# EAGLE schematic DistributedVisionSchematicPagePRAC (EAGLE 9.6.2)

## Sheet 1 of 4: Page 1
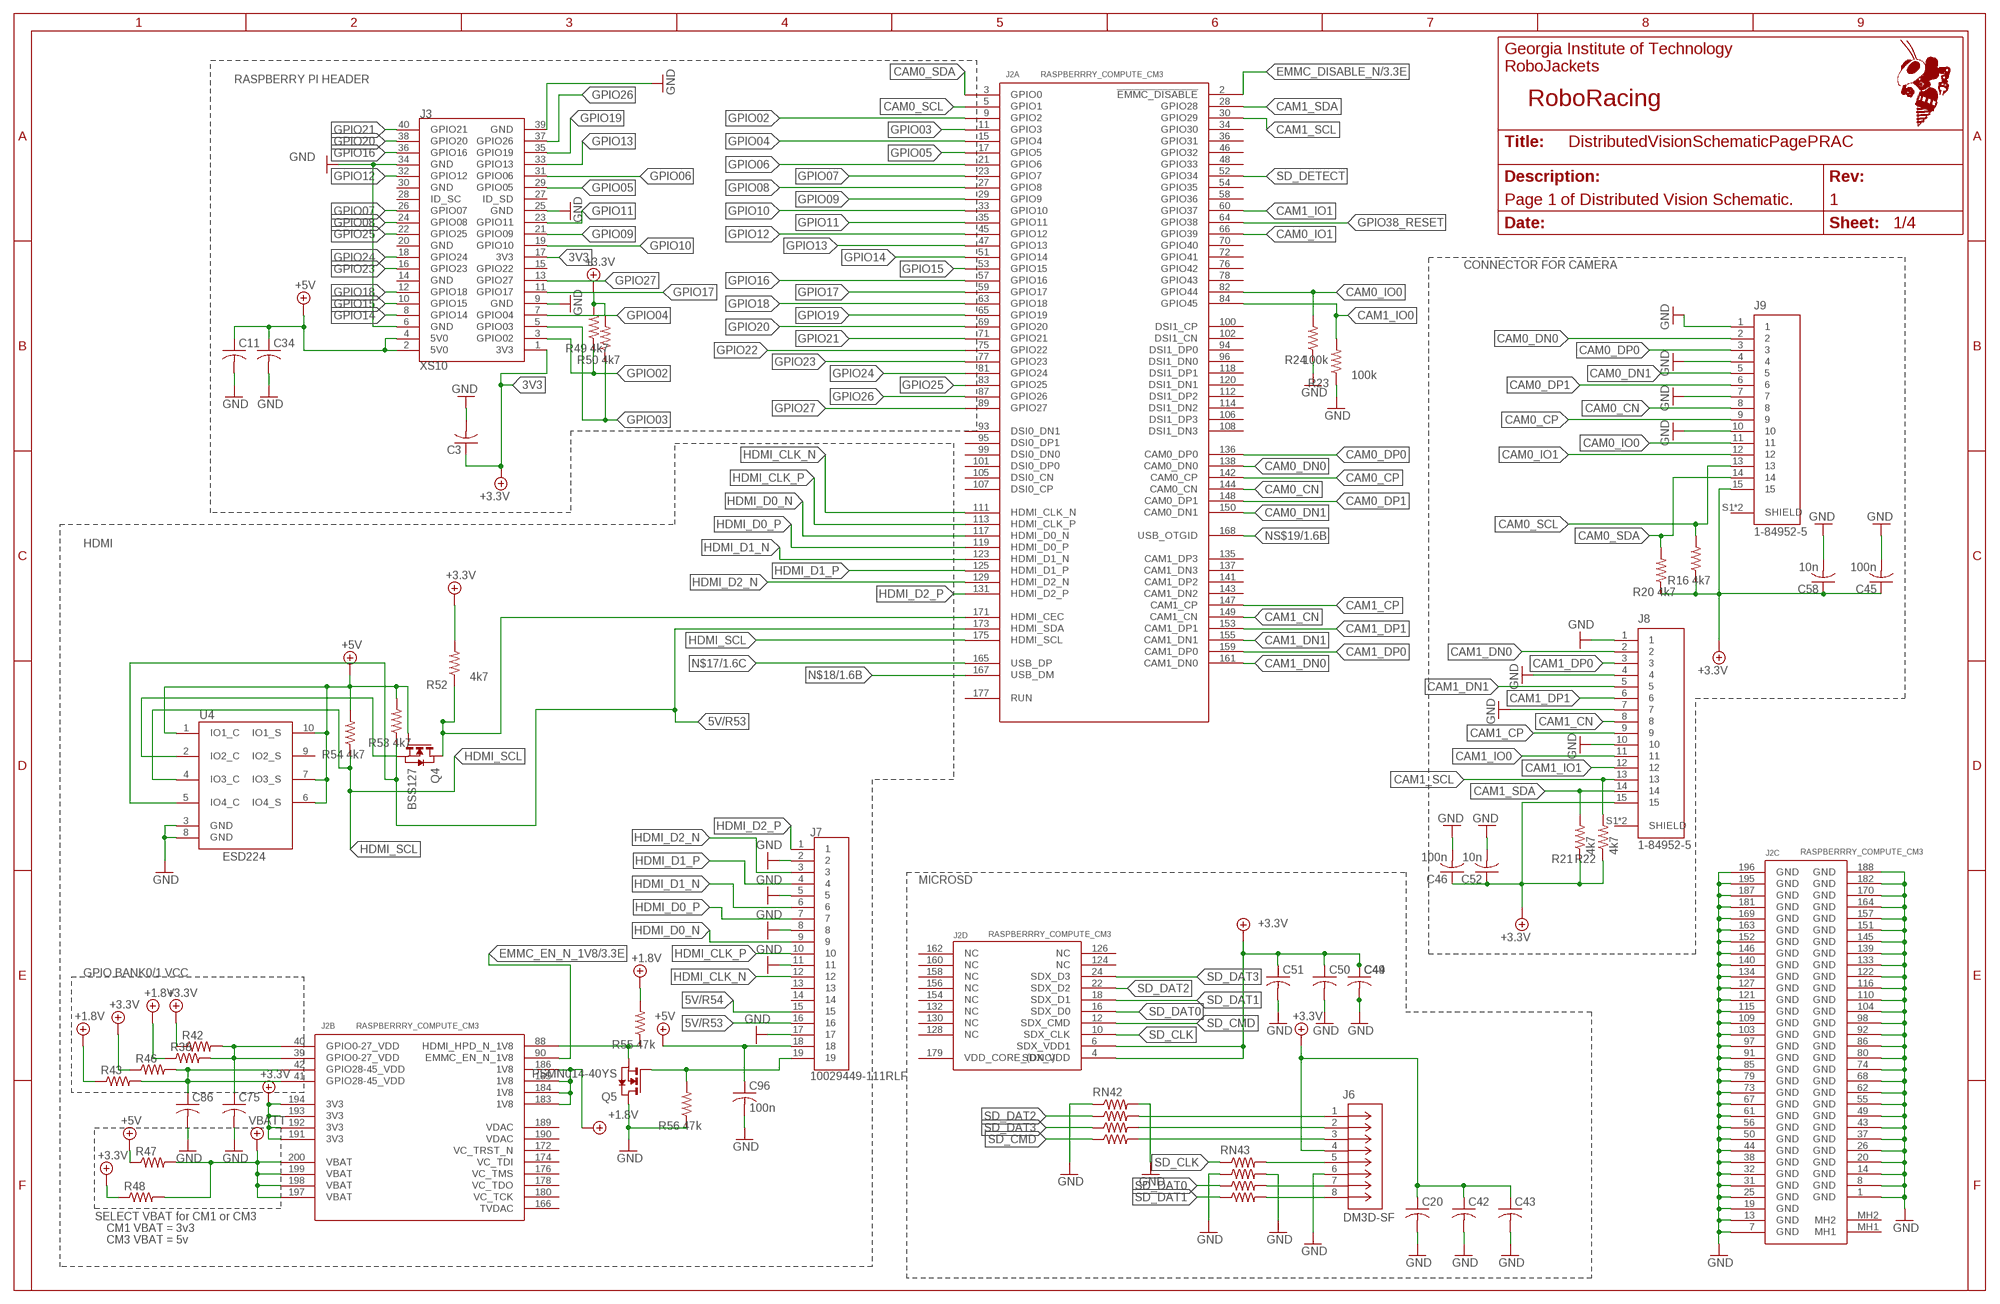
[diagram p0: schematic, sheet 1]
FRAME3 (FRAME_11_17): REVISION: 1; SCH_DESC: Page 1 of Distributed Vision Schematic.; TEAM: RoboRacing

### Parts
C3  C-USC0603  [C0603]
C11  C-USC0603  [C0603]
C20  C-USC0603  [C0603]
C34  C-USC0603  [C0603]
C42  C-USC0603  [C0603]
C43  C-USC0603  [C0603]
C44  C-USC0603  [C0603]
C45  100n  C-USC0603  [C0603]
C46  100n  C-USC0603  [C0603]
C49  C-USC0603  [C0603]
C50  C-USC0603  [C0603]
C51  C-USC0603  [C0603]
C52  10n  C-USC0603  [C0603]
C58  10n  C-USC0603  [C0603]
C75  C-USC0603  [C0603]
C86  C-USC0603  [C0603]
C96  100n  C-USC0603  [C0603]
J2  RASPBERRRY_COMPUTE_CM3  [TE_1473149-4_WITH_CM3PLUS]
J3  XS10  [RASPBERRYPI_BASTELSTUBE_V13_RASPI_BOARD_B+_FULL]
J6  DM3D-SF  [CONN8_DM3D-SF_HIR]
J7  10029449-111RLF  [CONN_1002944111_AMP]
J8  1-84952-5  [TE_1-84952-5]
J9  1-84952-5  [TE_1-84952-5]
Q4  BSS127  [SOT-23-3]
Q5  PSMN014-40YS  [LFPAK]
R16  4k7  R-US_R0603  [R0603]
R20  4k7  R-US_R0603  [R0603]
R21  4k7  R-US_R0603  [R0603]
R22  4k7  R-US_R0603  [R0603]
R23  100k  R-US_R0603  [R0603]
R24  100k  R-US_R0603  [R0603]
R38  R-US_R0603  [R0603]
R42  R-US_R0603  [R0603]
R43  R-US_R0603  [R0603]
R46  R-US_R0603  [R0603]
R47  R-US_R0603  [R0603]
R48  R-US_R0603  [R0603]
R49  4k7  R-US_R0603  [R0603]
R50  4k7  R-US_R0603  [R0603]
R52  4k7  R-US_R0603  [R0603]
R53  4k7  R-US_R0603  [R0603]
R54  4k7  R-US_R0603  [R0603]
R55  47k  R-US_R0603  [R0603]
R56  47k  ERJ-L06KF50MV  [RC0805N]
RN42  RA-41206  [RA-4_1206]
RN43  RA-41206  [RA-4_1206]
U4  ESD224  [USON(10)]

### Nets
3V3: C3.1 J3.1(3V3) J3.17(3V3) ; supply symbol labelled +3.3V
5V/R53: J2.173(A:HDMI_SDA) J7.16 R53.1 U4.5(IO4_C)
5V/R54: J7.15
+1.8V: J2.183(B:1V8) J2.184(B:1V8) J2.185(B:1V8) J2.186(B:1V8) R38.1 R43.1 R55.2 ; also sheet 3
+5V: C11.1 C34.1 C96.1 J3.2(5V0) J3.4(5V0) J7.18 Q4.1(G) R47.1 R53.2 R54.2 U4.1(IO1_C) U4.6(IO4_S) U4.7(IO3_S) U4.10(IO1_S) ; also sheet 3,4
CAM0_CN: J2.144(A:CAM0_CN) J9.8
CAM0_CP: J2.142(A:CAM0_CP) J9.9
CAM0_DN0: J2.138(A:CAM0_DN0) J9.2
CAM0_DN1: J2.150(A:CAM0_DN1) J9.5
CAM0_DP0: J2.136(A:CAM0_DP0) J9.3
CAM0_DP1: J2.148(A:CAM0_DP1) J9.6
CAM0_IO0: J2.82(A:GPIO44) J9.11 R24.2
CAM0_IO1: J2.66(A:GPIO39) J9.12
CAM0_SCL: J2.5(A:GPIO1) J9.13 R16.2
CAM0_SDA: J2.3(A:GPIO0) J9.14 R20.2
CAM1_CN: J2.149(A:CAM1_CN) J8.8
CAM1_CP: J2.147(A:CAM1_CP) J8.9
CAM1_DN0: J2.161(A:CAM1_DN0) J8.2
CAM1_DN1: J2.155(A:CAM1_DN1) J8.5
CAM1_DP0: J2.159(A:CAM1_DP0) J8.3
CAM1_DP1: J2.153(A:CAM1_DP1) J8.6
CAM1_IO0: J2.84(A:GPIO45) J8.11 R23.2
CAM1_IO1: J2.60(A:GPIO37) J8.12
CAM1_SCL: J2.30(A:GPIO29) J8.13 R22.2
CAM1_SDA: J2.28(A:GPIO28) J8.14 R21.2
EMMC_DISABLE_N: J2.2(A:!EMMC_DISABLE) ; also sheet 3
EMMC_EN_N_1V8: J2.90(B:EMMC_EN_N_1V8) ; also sheet 3
FB1: C20.1 C42.1 C43.1 C44.1 C45.1 C46.1 C49.1 C50.1 C51.1 C52.1 C58.1 J2.4(D:SDX_VDD) J2.6(D:SDX_VDD1) J2.191(B:3V3) J2.192(B:3V3) J2.193(B:3V3) J2.194(B:3V3) J6.4 J8.15 J9.15 R16.1 R20.1 R21.1 R22.1 R42.1 R46.1 R48.1 R49.2 R50.2 R52.2 ; supply symbol labelled +3.3V ; also sheet 3
GND: C3.2 C11.2 C20.2 C34.2 C42.2 C43.2 C44.2 C45.2 C46.2 C49.2 C50.2 C51.2 C52.2 C58.2 C75.2 C86.2 C96.2 J2.1(C:GND) J2.7(C:GND) J2.8(C:GND) J2.13(C:GND) J2.14(C:GND) J2.19(C:GND) J2.20(C:GND) J2.25(C:GND) J2.26(C:GND) J2.31(C:GND) J2.32(C:GND) J2.37(C:GND) J2.38(C:GND) J2.43(C:GND) J2.44(C:GND) J2.49(C:GND) J2.50(C:GND) J2.55(C:GND) J2.56(C:GND) J2.61(C:GND) J2.62(C:GND) J2.67(C:GND) J2.68(C:GND) J2.73(C:GND) J2.74(C:GND) J2.79(C:GND) J2.80(C:GND) J2.85(C:GND) J2.86(C:GND) J2.91(C:GND) J2.92(C:GND) J2.97(C:GND) J2.98(C:GND) J2.103(C:GND) J2.104(C:GND) J2.109(C:GND) J2.110(C:GND) J2.115(C:GND) J2.116(C:GND) J2.121(C:GND) J2.122(C:GND) J2.127(C:GND) J2.133(C:GND) J2.134(C:GND) J2.139(C:GND) J2.140(C:GND) J2.145(C:GND) J2.146(C:GND) J2.151(C:GND) J2.152(C:GND) J2.157(C:GND) J2.163(C:GND) J2.164(C:GND) J2.169(C:GND) J2.170(C:GND) J2.181(C:GND) J2.182(C:GND) J2.187(C:GND) J2.188(C:GND) J2.195(C:GND) J2.196(C:GND) J3.6(GND) J3.9(GND) J3.25(GND) J3.34(GND) J3.39(GND) J6.6 J7.2 J7.5 J7.8 J7.11 J7.17 J8.1 J8.4 J8.7 J8.10 J9.1 J9.4 J9.7 J9.10 Q5.MB(D) R23.1 R24.1 R56.1(PIN1) RN42.1 RN42.2 RN43.3 RN43.4 U4.3(GND) U4.8(GND) ; also sheet 2,3,4
GPIO02: J2.9(A:GPIO2) J3.3(GPIO02) R49.1
GPIO03: J2.11(A:GPIO3) J3.5(GPIO03) R50.1
GPIO04: J2.15(A:GPIO4) J3.7(GPIO04)
GPIO05: J2.17(A:GPIO5) J3.29(GPIO05)
GPIO06: J2.21(A:GPIO6) J3.31(GPIO06)
GPIO07: J2.23(A:GPIO7) J3.26(GPIO07)
GPIO08: J2.27(A:GPIO8) J3.24(GPIO08)
GPIO09: J2.29(A:GPIO9) J3.21(GPIO09)
GPIO10: J2.33(A:GPIO10) J3.19(GPIO10)
GPIO11: J2.35(A:GPIO11) J3.23(GPIO11)
GPIO12: J2.45(A:GPIO12) J3.32(GPIO12)
GPIO13: J2.47(A:GPIO13) J3.33(GPIO13)
GPIO14: J2.51(A:GPIO14) J3.8(GPIO14)
GPIO15: J2.53(A:GPIO15) J3.10(GPIO15)
GPIO16: J2.57(A:GPIO16) J3.36(GPIO16)
GPIO17: J2.59(A:GPIO17) J3.11(GPIO17)
GPIO18: J2.63(A:GPIO18) J3.12(GPIO18)
GPIO19: J2.65(A:GPIO19) J3.35(GPIO19)
GPIO20: J2.69(A:GPIO20) J3.38(GPIO20)
GPIO21: J2.71(A:GPIO21) J3.40(GPIO21)
GPIO22: J2.75(A:GPIO22)
GPIO23: J2.77(A:GPIO23) J3.16(GPIO23)
GPIO24: J2.81(A:GPIO24) J3.18(GPIO24)
GPIO25: J2.83(A:GPIO25) J3.22(GPIO25)
GPIO26: J2.87(A:GPIO26) J3.37(GPIO26)
GPIO27: J2.89(A:GPIO27) J3.13(GPIO27)
GPIO38_RESET: J2.64(A:GPIO38)
HDMI_CLK_N: J2.111(A:HDMI_CLK_N) J7.12
HDMI_CLK_P: J2.113(A:HDMI_CLK_P) J7.10
HDMI_D0_N: J2.117(A:HDMI_D0_N) J7.9
HDMI_D0_P: J2.119(A:HDMI_D0_P) J7.7
HDMI_D1_N: J2.123(A:HDMI_D1_N) J7.6
HDMI_D1_P: J2.125(A:HDMI_D1_P) J7.4
HDMI_D2_N: J2.129(A:HDMI_D2_N) J7.3
HDMI_D2_P: J2.131(A:HDMI_D2_P) J7.1
HDMI_SCL: J2.175(A:HDMI_SCL) R54.1 U4.4(IO3_C)
N$12: C75.1 J2.39(B:GPIO0-27_VDD) J2.40(B:GPIO0-27_VDD) R38.2 R42.2
N$17/1.6C: J2.165(A:USB_DP)
N$18/1.6B: J2.167(A:USB_DM)
N$24: C86.1 J2.41(B:GPIO28-45_VDD) J2.42(B:GPIO28-45_VDD) R43.2 R46.2
N$30: J2.88(B:HDMI_HPD_N_1V8) Q5.1(S) Q5.2(S) Q5.3(S) R55.1 ; also sheet 2
N$45: J7.19 Q5.4(G) R56.2(PIN2)
N$46: J6.1 RN42.4
N$47: J6.2 RN42.6
N$48: J6.3 RN42.8
N$49: J6.5 RN43.2
N$50: J6.7 RN43.6
N$51: J6.8 RN43.8
N$52: J2.171(A:HDMI_CEC) Q4.3(D) R52.1
N$53: Q4.2(S) U4.2(IO2_C)
NS$19/1.6B: J2.168(A:USB_OTGID)
SD_CLK: J2.10(D:SDX_CLK) RN43.1
SD_CMD: J2.12(D:SDX_CMD) RN42.7
SD_DAT0: J2.16(D:SDX_D0) RN43.5
SD_DAT1: J2.18(D:SDX_D1) RN43.7
SD_DAT2: J2.22(D:SDX_D2) RN42.3
SD_DAT3: J2.24(D:SDX_D3) RN42.5
SD_DETECT: J2.52(A:GPIO34)
VBATT: J2.197(B:VBAT) J2.198(B:VBAT) J2.199(B:VBAT) J2.200(B:VBAT) R47.2 R48.2 ; also sheet 3
Unconnected: J2.34(A:GPIO30) J2.36(A:GPIO31) J2.46(A:GPIO32) J2.48(A:GPIO33) J2.54(A:GPIO35) J2.58(A:GPIO36) J2.70(A:GPIO40) J2.72(A:GPIO41) J2.76(A:GPIO42) J2.78(A:GPIO43) J2.93(A:DSI0_DN1) J2.94(A:DSI1_DP0) J2.95(A:DSI0_DP1) J2.96(A:DSI1_DN0) J2.99(A:DSI0_DN0) J2.100(A:DSI1_CP) J2.101(A:DSI0_DP0) J2.102(A:DSI1_CN) J2.105(A:DSI0_CN) J2.106(A:DSI1_DP3) J2.107(A:DSI0_CP) J2.108(A:DSI1_DN3) J2.112(A:DSI1_DP2) J2.114(A:DSI1_DN2) J2.118(A:DSI1_DP1) J2.120(A:DSI1_DN1) J2.124(D:NC) J2.126(D:NC) J2.128(D:NC) J2.130(D:NC) J2.132(D:NC) J2.135(A:CAM1_DP3) J2.137(A:CAM1_DN3) J2.141(A:CAM1_DP2) J2.143(A:CAM1_DN2) J2.154(D:NC) J2.156(D:NC) J2.158(D:NC) J2.160(D:NC) J2.162(D:NC) J2.166(B:TVDAC) J2.172(B:VC_TRST_N) J2.174(B:VC_TDI) J2.176(B:VC_TMS) J2.177(A:RUN) J2.179(D:VDD_CORE_(DNC)) J2.MH1(C:MH1) J2.MH2(C:MH2) J3.14(GND) J3.15(GPIO22) J3.20(GND) J3.27(ID_SD) J3.28(ID_SC) J3.30(GND) J7.13 J7.14 J8.S1(SHIELD) J8.S2(SHIELD) J9.S1(SHIELD) J9.S2(SHIELD) U4.9(IO2_S)

### Notes on the sheet
- RASPBERRY PI HEADER
- CONNECTOR FOR CAMERA
- HDMI
- MICROSD
- GPIO BANK0/1 VCC
- SELECT VBAT for CM1 or CM3
- CM1 VBAT = 3v3
- CM3 VBAT = 5v

## Sheet 2 of 4
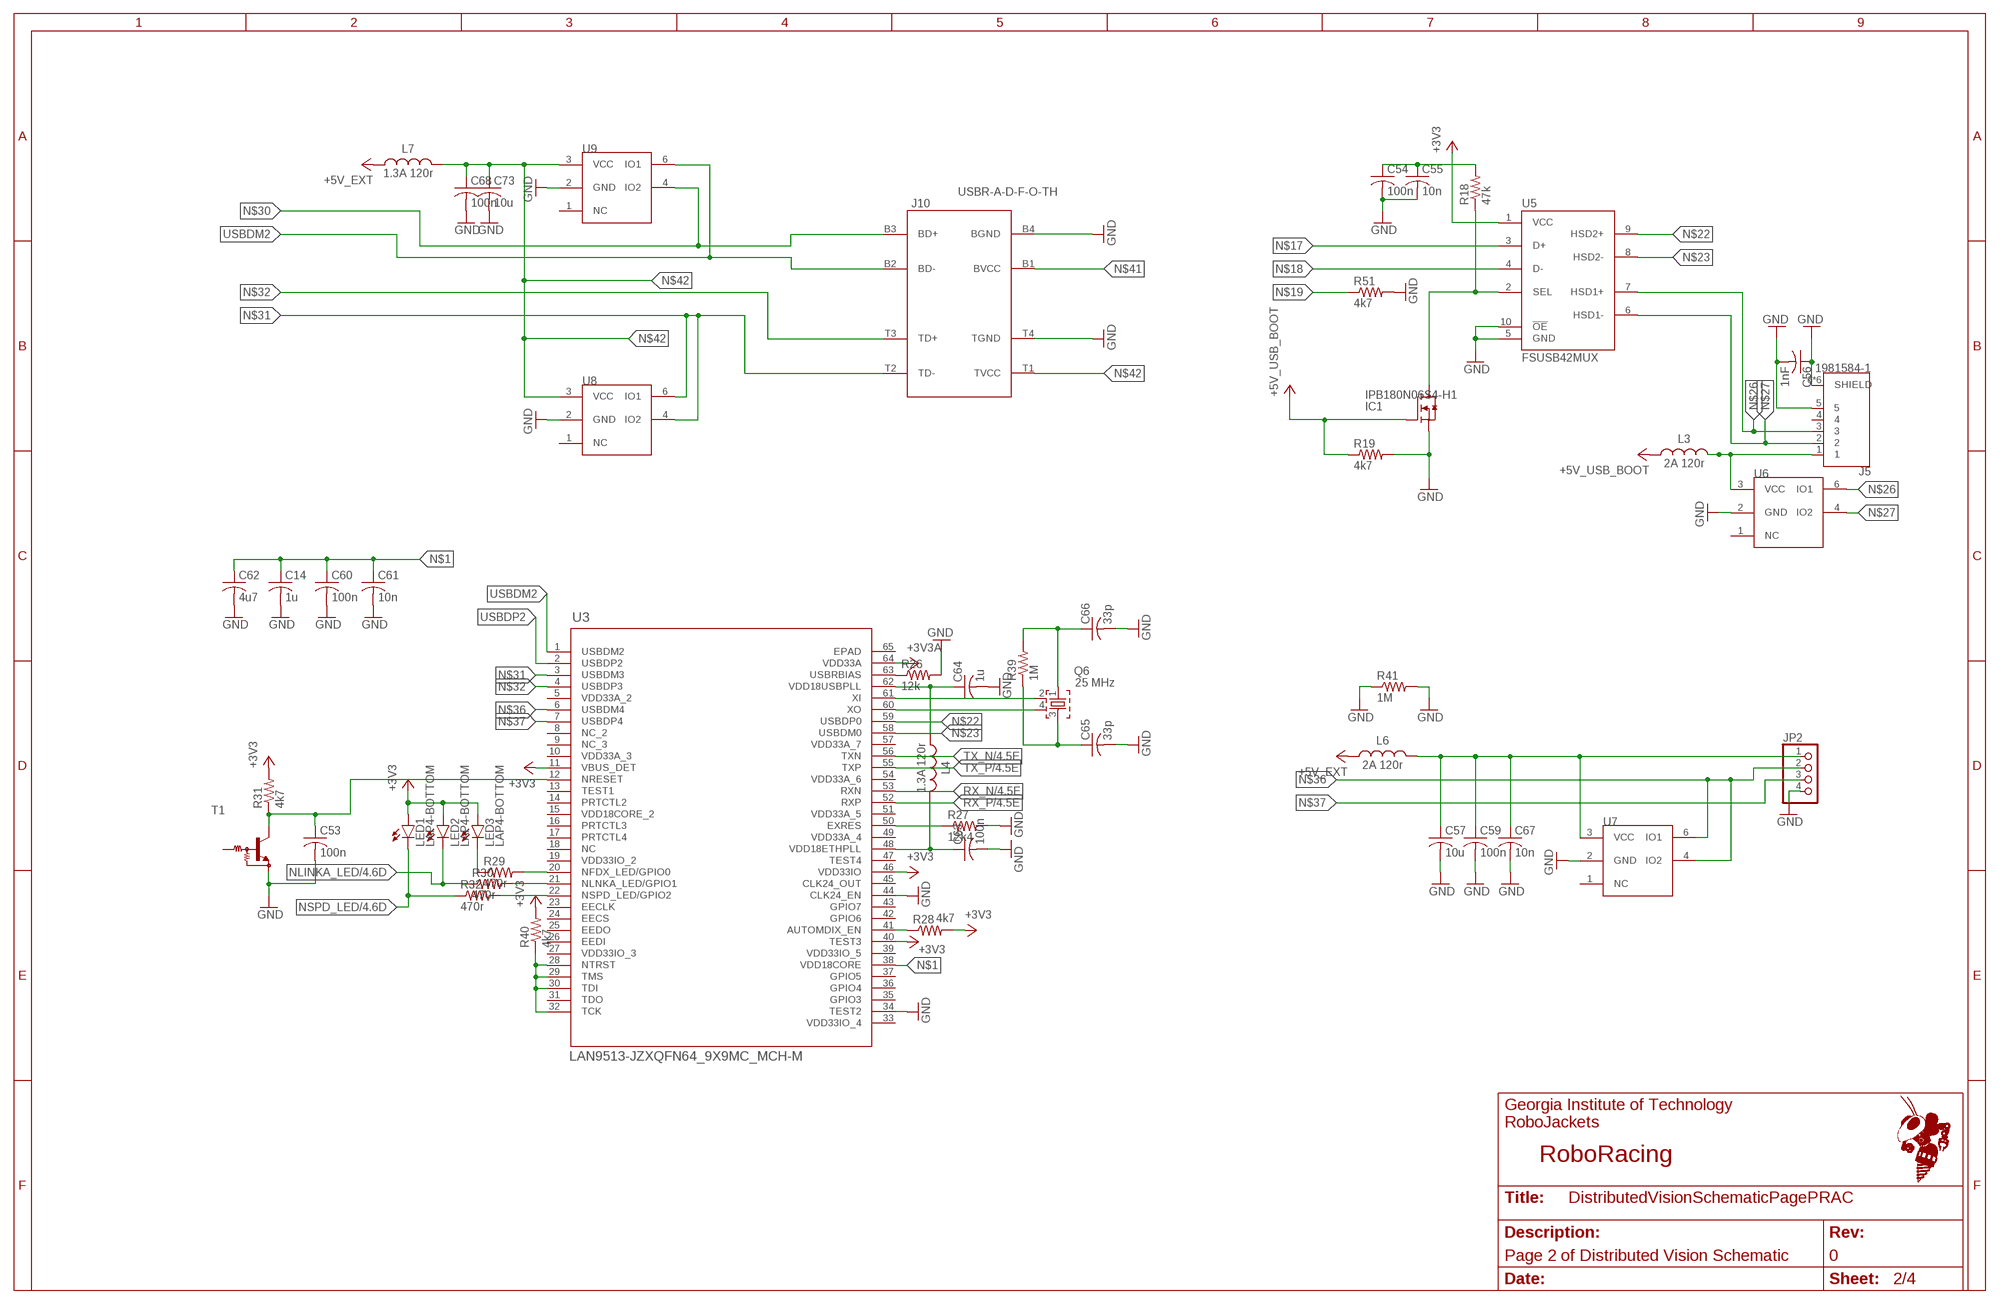
[diagram p1: schematic, sheet 2]
FRAME1 (FRAME_11_17): REVISION: 0; SCH_DESC: Page 2 of Distributed Vision Schematic; TEAM: RoboRacing

### Parts
C14  1u  C-USC0402  [C0402]
C53  100n  C-USC0402  [C0402]
C54  100n  C-USC0402  [C0402]
C55  10n  C-USC0402  [C0402]
C56  1nF  C-USC0402  [C0402]
C57  10u  C-USC0402  [C0402]
C59  100n  C-USC0402  [C0402]
C60  100n  C-USC0402  [C0402]
C61  10n  C-USC0402  [C0402]
C62  4u7  C-USC0402  [C0402]
C63  100n  C-USC0402  [C0402]
C64  1u  C-USC0402  [C0402]
C65  33p  C-USC0402  [C0402]
C66  33p  C-USC0402  [C0402]
C67  10n  C-USC0402  [C0402]
C68  100n  C-USC0402  [C0402]
C73  10u  C-USC0402  [C0402]
IC1  IPB180N06S4-H1  [PG-TO263-7-3]
J5  1981584-1  [TE_1981584-1]
J10  USBR-A-D-F-O-TH  [USBR-A-D-F-O-TH]
JP2  PINHD-1X4  [1X04]
L3  2A 120r  INDUCTOR_0805  [0805]
L4  1.3A 120r  INDUCTOR_0805  [0805]
L6  2A 120r  INDUCTOR_0805  [0805]
L7  1.3A 120r  INDUCTOR_0805  [0805]
LED1  LAP4-BOTTOM  [P47F-BOTTOM]
LED2  LAP4-BOTTOM  [P47F-BOTTOM]
LED3  LAP4-BOTTOM  [P47F-BOTTOM]
Q6  25 MHz  FA-20H  [FA-20H]
R18  47k  ERJ-L06KF50MV  [RC0805N]
R19  4k7  ERJ-L06KF50MV  [RC0805N]
R26  12k  ERJ-L06KF50MV  [RC0805N]
R27  12k4  ERJ-L06KF50MV  [RC0805N]
R28  4k7  ERJ-L06KF50MV  [RC0805N]
R29  470r  ERJ-L06KF50MV  [RC0805N]
R30  470r  ERJ-L06KF50MV  [RC0805N]
R31  4k7  ERJ-L06KF50MV  [RC0805N]
R32  470r  ERJ-L06KF50MV  [RC0805N]
R39  1M  ERJ-L06KF50MV  [RC0805N]
R40  4k7  ERJ-L06KF50MV  [RC0805N]
R41  1M  ERJ-L06KF50MV  [RC0805N]
R51  4k7  ERJ-L06KF50MV  [RC0805N]
T1  MUN2211T1-NPN_DRIVER-SC59-BEC  [SC59-BEC]
U3  LAN9513-JZXQFN64_9X9MC_MCH-M  [QFN64_9X9MC_MCH-M]
U5  FSUSB42MUX  [10-MSOP]
U6  SP3003-02  [SC70-5]
U7  SP3003-02  [SC70-5]
U8  SP3003-02  [SC70-5]
U9  SP3003-02  [SC70-5]

### Nets
GND: C14.2 C53.2 C54.2 C55.2 C56.1 C56.2 C57.2 C59.2 C60.2 C61.2 C62.2 C63.2 C64.2 C65.2 C66.2 C67.2 C68.2 C73.2 IC1.2(S) IC1.3(S) IC1.5(S) IC1.6(S) IC1.7(S) J5.5 J5.6(SHIELD) J5.7(SHIELD) J5.8(SHIELD) J5.9(SHIELD) J5.10(SHIELD) J5.11(SHIELD) J10.B4(BGND) J10.T4(TGND) JP2.4 R19.2(PIN2) R26.2(PIN2) R27.2(PIN2) R41.1(PIN1) R41.2(PIN2) R51.2(PIN2) T1.E U3.34(TEST2) U3.44(CLK24_EN) U5.5(GND) U5.10(!OE) U6.2(GND) U7.2(GND) U8.2(GND) U9.2(GND) ; also sheet 1,3,4
N$1: C14.1 C60.1 C61.1 C62.1 U3.38(VDD18CORE) ; also sheet 3
N$17: U5.3(D+)
N$18: U5.4(D-)
N$19: R51.1(PIN1)
N$22: U3.59(USBDP0) U5.9(HSD2+)
N$23: U3.58(USBDM0) U5.8(HSD2-)
N$26: J5.3 U5.7(HSD1+) U6.6(IO1)
N$27: J5.2 U5.6(HSD1-) U6.4(IO2)
N$30: J10.B3(BD+) U9.4(IO2) ; also sheet 1
N$31: J10.T2(TD-) U3.3(USBDM3) U8.4(IO2) U8.6(IO1) ; also sheet 3
N$32: J10.T3(TD+) U3.4(USBDP3) ; also sheet 3
N$36: JP2.2 U3.6(USBDM4) U7.4(IO2) U7.6(IO1) ; also sheet 3
N$37: JP2.3 U3.7(USBDP4) ; also sheet 3
N$41: J10.B1(BVCC) ; also sheet 3
N$42: C68.1 C73.1 J10.T1(TVCC) L7.2 U8.3(VCC) U9.3(VCC)
N$55: C64.1 L4.1 U3.62(VDD18USBPLL)
N$56: C63.1 L4.2 U3.48(VDD18ETHPLL)
N$57: R29.2(PIN2) U3.20(NFDX_LED/GPIO0)
N$58: R30.2(PIN2) U3.21(NLNKA_LED/GPIO1)
N$59: R32.2(PIN2) U3.22(NSPD_LED/GPIO2)
N$60: LED3.C R29.1(PIN1)
N$61: C53.1 R31.1(PIN1) T1.C U3.12(NRESET)
N$63: R40.1(PIN1) U3.28(NTRST) U3.29(TMS) U3.30(TDI) U3.32(TCK)
N$64: Q6.2 U3.61(XI)
N$65: Q6.4 U3.60(XO)
N$66: C66.1 Q6.1 R39.2(PIN2)
N$67: C65.1 Q6.3 R39.1(PIN1)
N$68: IC1.8(D) R18.1(PIN1) U5.2(SEL)
N$69: R26.1(PIN1) U3.63(USBRBIAS)
N$70: R28.1(PIN1) U3.41(AUTOMDIX_EN)
N$71: R27.1(PIN1) U3.50(EXRES)
N$72: J5.1 L3.2 U6.3(VCC)
N$73: C57.1 C59.1 C67.1 JP2.1 L6.2 U7.3(VCC)
N$75: C54.1 C55.1 R18.2(PIN2)
NLINKA_LED: LED2.C R30.1(PIN1) ; also sheet 4
NSPD_LED: LED1.C R32.1(PIN1) ; also sheet 4
RX_N [ethernet]: U3.53(RXN) ; also sheet 3,4
RX_P [ethernet]: U3.52(RXP) ; also sheet 3,4
TX_N [ethernet]: U3.56(TXN) ; also sheet 3,4
TX_P [ethernet]: U3.55(TXP) ; also sheet 3,4
USBDM2: J10.B2(BD-) U3.1(USBDM2) U9.6(IO1)
USBDP2: U3.2(USBDP2)
VCC: IC1.1(G) L3.1 L6.1 L7.1 LED1.A LED2.A LED3.A R19.1(PIN1) R28.2(PIN2) R31.2(PIN2) R40.2(PIN2) U3.11(VBUS_DET) U3.40(TEST3) U3.46(VDD33IO) U3.64(VDD33A) U5.1(VCC) ; supply symbol labelled +3V3, +3V3A, +5V_USB_BOOT, +5V_EXT
Unconnected: J5.4 T1.B U3.8(NC_2) U3.9(NC_3) U3.13(TEST1) U3.14(PRTCTL2) U3.16(PRTCTL3) U3.17(PRTCTL4) U3.18(NC) U3.23(EECLK) U3.24(EECS) U3.25(EEDO) U3.26(EEDI) U3.31(TDO) U3.35(GPIO3) U3.36(GPIO4) U3.37(GPIO5) U3.42(GPIO6) U3.43(GPIO7) U3.45(CLK24_OUT) U3.47(TEST4) U3.65(EPAD) U6.1(NC) U7.1(NC) U8.1(NC) U9.1(NC)

## Sheet 3 of 4: Page 3
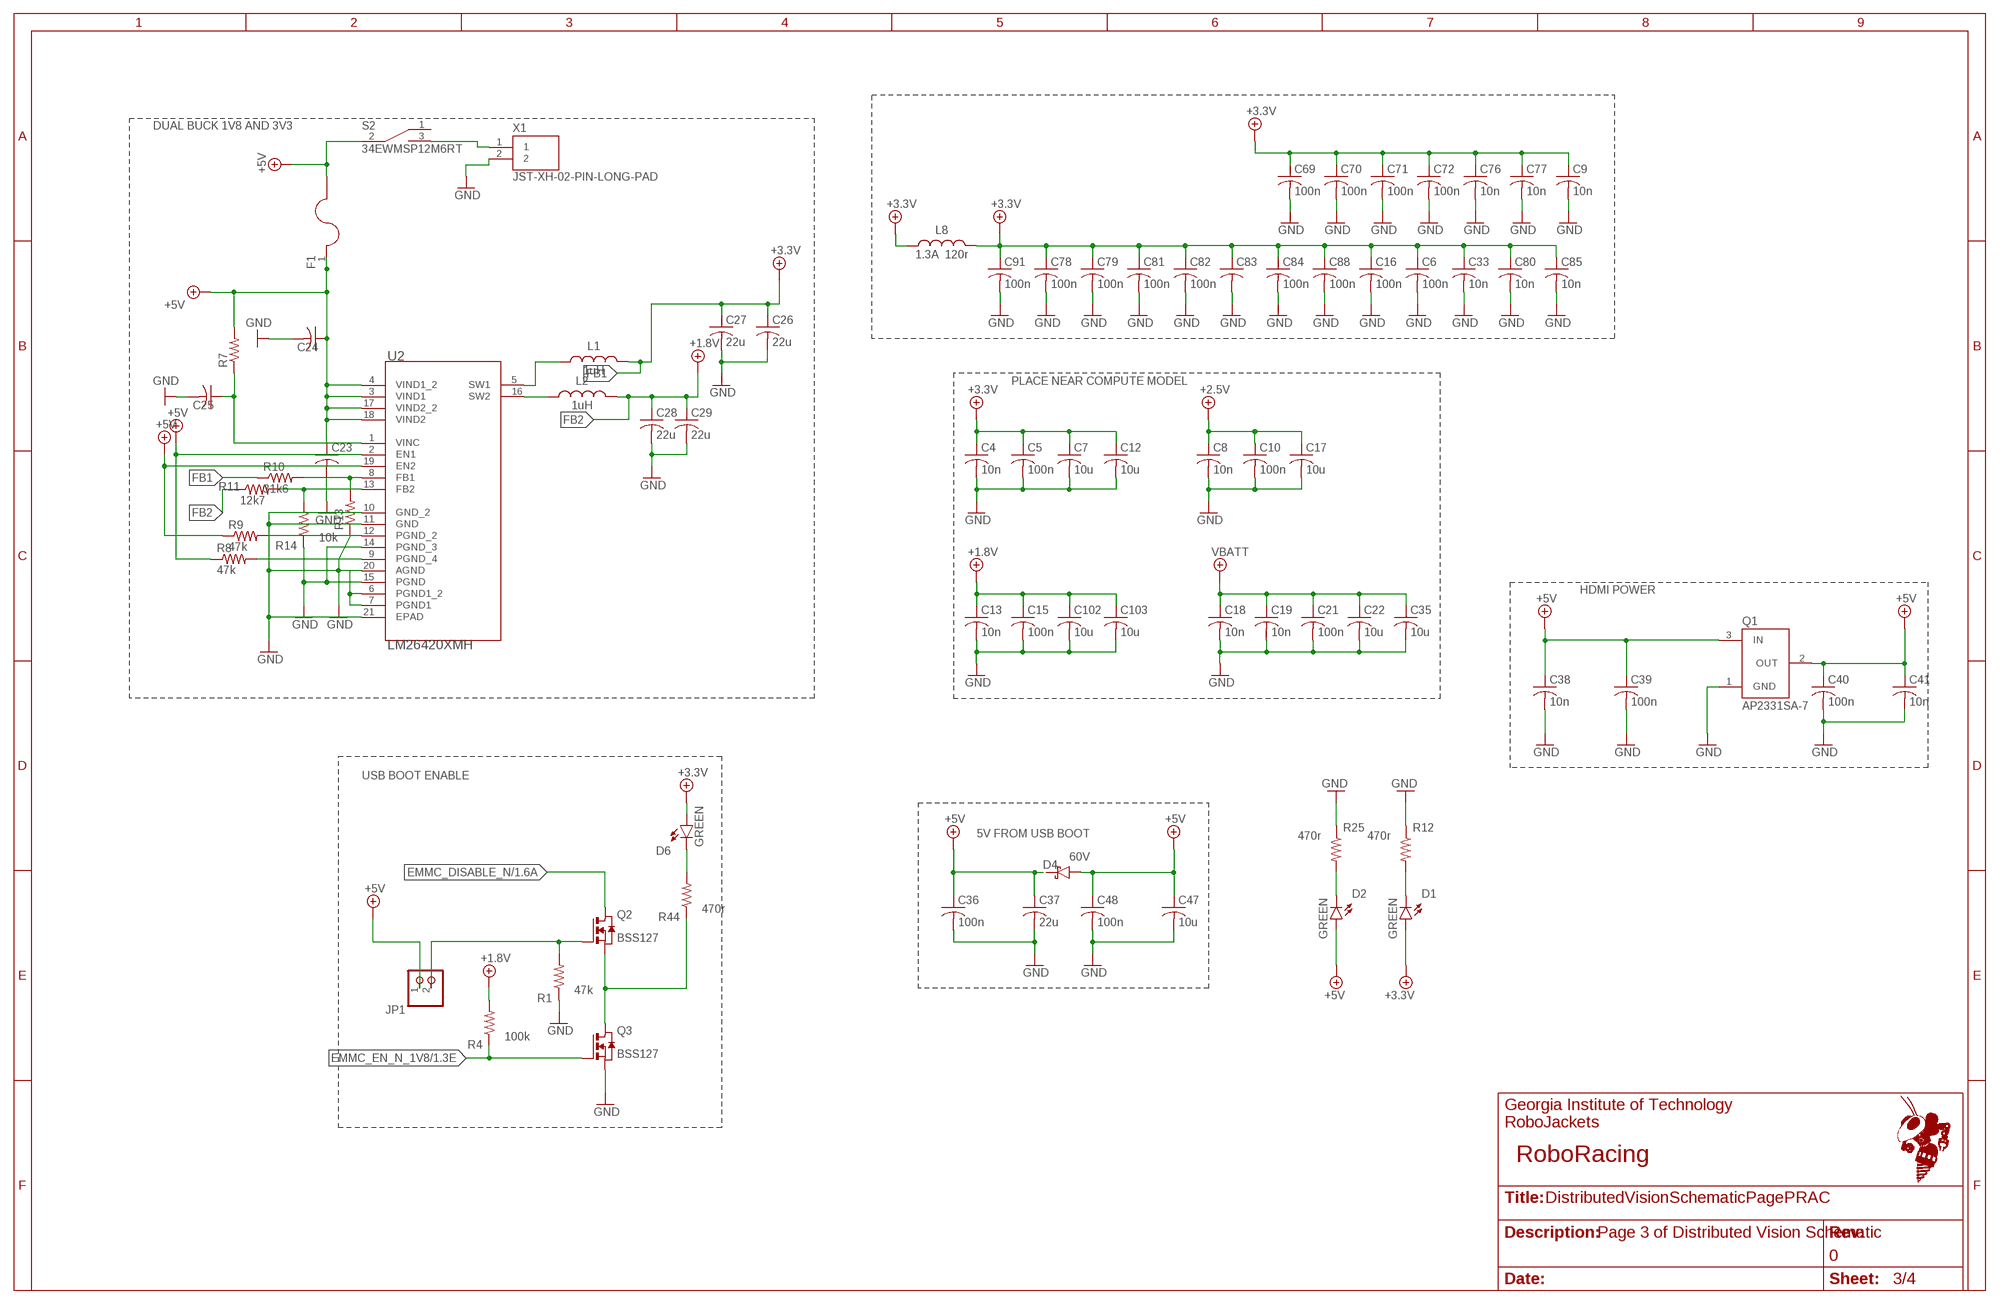
[diagram p2: schematic, sheet 3]
FRAME2 (FRAME_11_17): REVISION: 0; SCH_DESC: Page 3 of Distributed Vision Schematic; TEAM: RoboRacing

### Parts
C4  10n  C-USC0603  [C0603]
C5  100n  C-USC0603  [C0603]
C6  100n  C-USC0603  [C0603]
C7  10u  C-USC0603  [C0603]
C8  10n  C-USC0603  [C0603]
C9  10n  C-USC0603  [C0603]
C10  100n  C-USC0603  [C0603]
C12  10u  C-USC0603  [C0603]
C13  10n  C-USC0603  [C0603]
C15  100n  C-USC0603  [C0603]
C16  100n  C-USC0603  [C0603]
C17  10u  C-USC0603  [C0603]
C18  10n  C-USC0603  [C0603]
C19  10n  C-USC0603  [C0603]
C21  100n  C-USC0603  [C0603]
C22  10u  C-USC0603  [C0603]
C23  C-USC0603  [C0603]
C24  C-USC0603  [C0603]
C25  C-USC0603  [C0603]
C26  22u  C-USC0805  [C0805]
C27  22u  C-USC0805  [C0805]
C28  22u  C-USC0805  [C0805]
C29  22u  C-USC0805  [C0805]
C33  10n  C-USC0603  [C0603]
C35  10u  C-USC0603  [C0603]
C36  100n  C-USC0603  [C0603]
C37  22u  C-USC0603  [C0603]
C38  10n  C-USC0603  [C0603]
C39  100n  C-USC0603  [C0603]
C40  100n  C-USC0603  [C0603]
C41  10n  C-USC0603  [C0603]
C47  10u  C-USC0603  [C0603]
C48  100n  C-USC0603  [C0603]
C69  100n  C-USC0603  [C0603]
C70  100n  C-USC0603  [C0603]
C71  100n  C-USC0603  [C0603]
C72  100n  C-USC0603  [C0603]
C76  10n  C-USC0603  [C0603]
C77  10n  C-USC0603  [C0603]
C78  100n  C-USC0603  [C0603]
C79  100n  C-USC0603  [C0603]
C80  10n  C-USC0603  [C0603]
C81  100n  C-USC0603  [C0603]
C82  100n  C-USC0603  [C0603]
C83  C-USC0603  [C0603]
C84  100n  C-USC0603  [C0603]
C85  10n  C-USC0603  [C0603]
C88  100n  C-USC0603  [C0603]
C91  100n  C-USC0603  [C0603]
C102  10u  C-USC0603  [C0603]
C103  10u  C-USC0603  [C0603]
D1  GREEN  LED-GREEN0603  [LED-0603]
D2  GREEN  LED-GREEN0603  [LED-0603]
D4  60V  DFLS160-7  [POWERDI-123]
D6  GREEN  LED-GREEN0603  [LED-0603]
F1  PTCFUSE-1812  [1812]
JP1  PINHD-1X2  [1X02]
L1  1uH  INDUCTOR_0805  [0805]
L2  1uH  INDUCTOR_0805  [0805]
L8  1.3A 120r  INDUCTOR_0805  [0805]
Q1  AP2331SA-7  [SOT23]
Q2  BSS127  [SOT-23-3]
Q3  BSS127  [SOT-23-3]
R1  47k  R-US_R0603  [R0603]
R4  100k  R-US_R0603  [R0603]
R7  R-US_R0603  [R0603]
R8  47k  R-US_R0603  [R0603]
R9  47k  R-US_R0603  [R0603]
R10  31k6  R-US_R0603  [R0603]
R11  12k7  R-US_R0603  [R0603]
R12  470r  R-US_R0603  [R0603]
R13  R-US_R0603  [R0603]
R14  10k  R-US_R0603  [R0603]
R25  470r  R-US_R0603  [R0603]
R44  470r  R-US_R0603  [R0603]
S2  34EWMSP12M6RT  [34EWMSP12M6RT]
U2  LM26420XMH  [PWP0020A]
X1  JST-XH-02-PIN-LONG-PAD  [JST-XH-02-PACKAGE-LONG-PAD]

### Nets
+1.8V: C13.1 C15.1 C102.1 C103.1 R4.2 ; also sheet 1
+2.5V: C8.1 C10.1 C17.1
+5V: C23.1 C24.1 C36.1 C37.1 C38.1 C39.1 C40.1 C41.1 C47.1 C48.1 D2.A D4.A D4.C F1.1 F1.2 JP1.1 Q1.2(OUT) Q1.3(IN) R7.2 R8.1 R9.1 S2.2(COMMON) U2.2(EN1) U2.3(VIND1) U2.4(VIND1_2) U2.17(VIND2_2) U2.18(VIND2) U2.19(EN2) ; also sheet 1,4
EMMC_DISABLE_N: Q2.3(D) ; also sheet 1
EMMC_EN_N_1V8: Q3.1(G) R4.1 ; also sheet 1
FB1: C4.1 C5.1 C6.1 C7.1 C9.1 C12.1 C16.1 C26.1 C27.1 C33.1 C69.1 C70.1 C71.1 C72.1 C76.1 C77.1 C78.1 C79.1 C80.1 C81.1 C82.1 C83.1 C84.1 C85.1 C88.1 C91.1 D1.A D6.A L1.2 L8.1 L8.2 R10.1 ; supply symbol labelled +3.3V ; also sheet 1
FB2: C28.1 C29.1 L2.2 R11.1 ; supply symbol labelled +1.8V
GND: C4.2 C5.2 C6.2 C7.2 C8.2 C9.2 C10.2 C12.2 C13.2 C15.2 C16.2 C17.2 C18.2 C19.2 C21.2 C22.2 C23.2 C24.2 C25.2 C26.2 C27.2 C28.2 C29.2 C33.2 C35.2 C36.2 C37.2 C38.2 C39.2 C40.2 C41.2 C47.2 C48.2 C69.2 C70.2 C71.2 C72.2 C76.2 C77.2 C78.2 C79.2 C80.2 C81.2 C82.2 C83.2 C84.2 C85.2 C88.2 C91.2 C102.2 C103.2 Q1.1(GND) Q3.2(S) R1.1 R12.1 R13.1 R14.1 R25.1 U2.6(PGND1_2) U2.7(PGND1) U2.10(GND_2) U2.11(GND) U2.14(PGND_3) U2.15(PGND) U2.20(AGND) U2.21(EPAD) X1.2 ; also sheet 1,2,4
N$1: R10.2 R13.2 U2.8(FB1) ; also sheet 2
N$5: C25.1 R7.1 U2.1(VINC)
N$31: Q2.2(S) Q3.3(D) R44.1 ; also sheet 2
N$32: D6.C R44.2 ; also sheet 2
N$33: JP1.2 Q2.1(G) R1.2
N$36: L2.1 U2.16(SW2) ; also sheet 2
N$37: R11.2 R14.2 U2.13(FB2) ; also sheet 2
N$40: R8.2 U2.9(PGND_4)
N$41: S2.3(B) X1.1 ; also sheet 2
RX_N [ethernet]: L1.1 U2.5(SW1) ; also sheet 2,4
RX_P [ethernet]: R9.2 U2.12(PGND_2) ; also sheet 2,4
TX_N [ethernet]: D2.C R25.2 ; also sheet 2,4
TX_P [ethernet]: D1.C R12.2 ; also sheet 2,4
VBATT: C18.1 C19.1 C21.1 C22.1 C35.1 ; also sheet 1
Unconnected: S2.1(A) S2.LEG1 S2.LEG3(LEG2)

### Notes on the sheet
- DUAL BUCK 1V8 AND 3V3
- PLACE NEAR COMPUTE MODEL
- HDMI POWER
- USB BOOT ENABLE
- 5V FROM USB BOOT

## Sheet 4 of 4
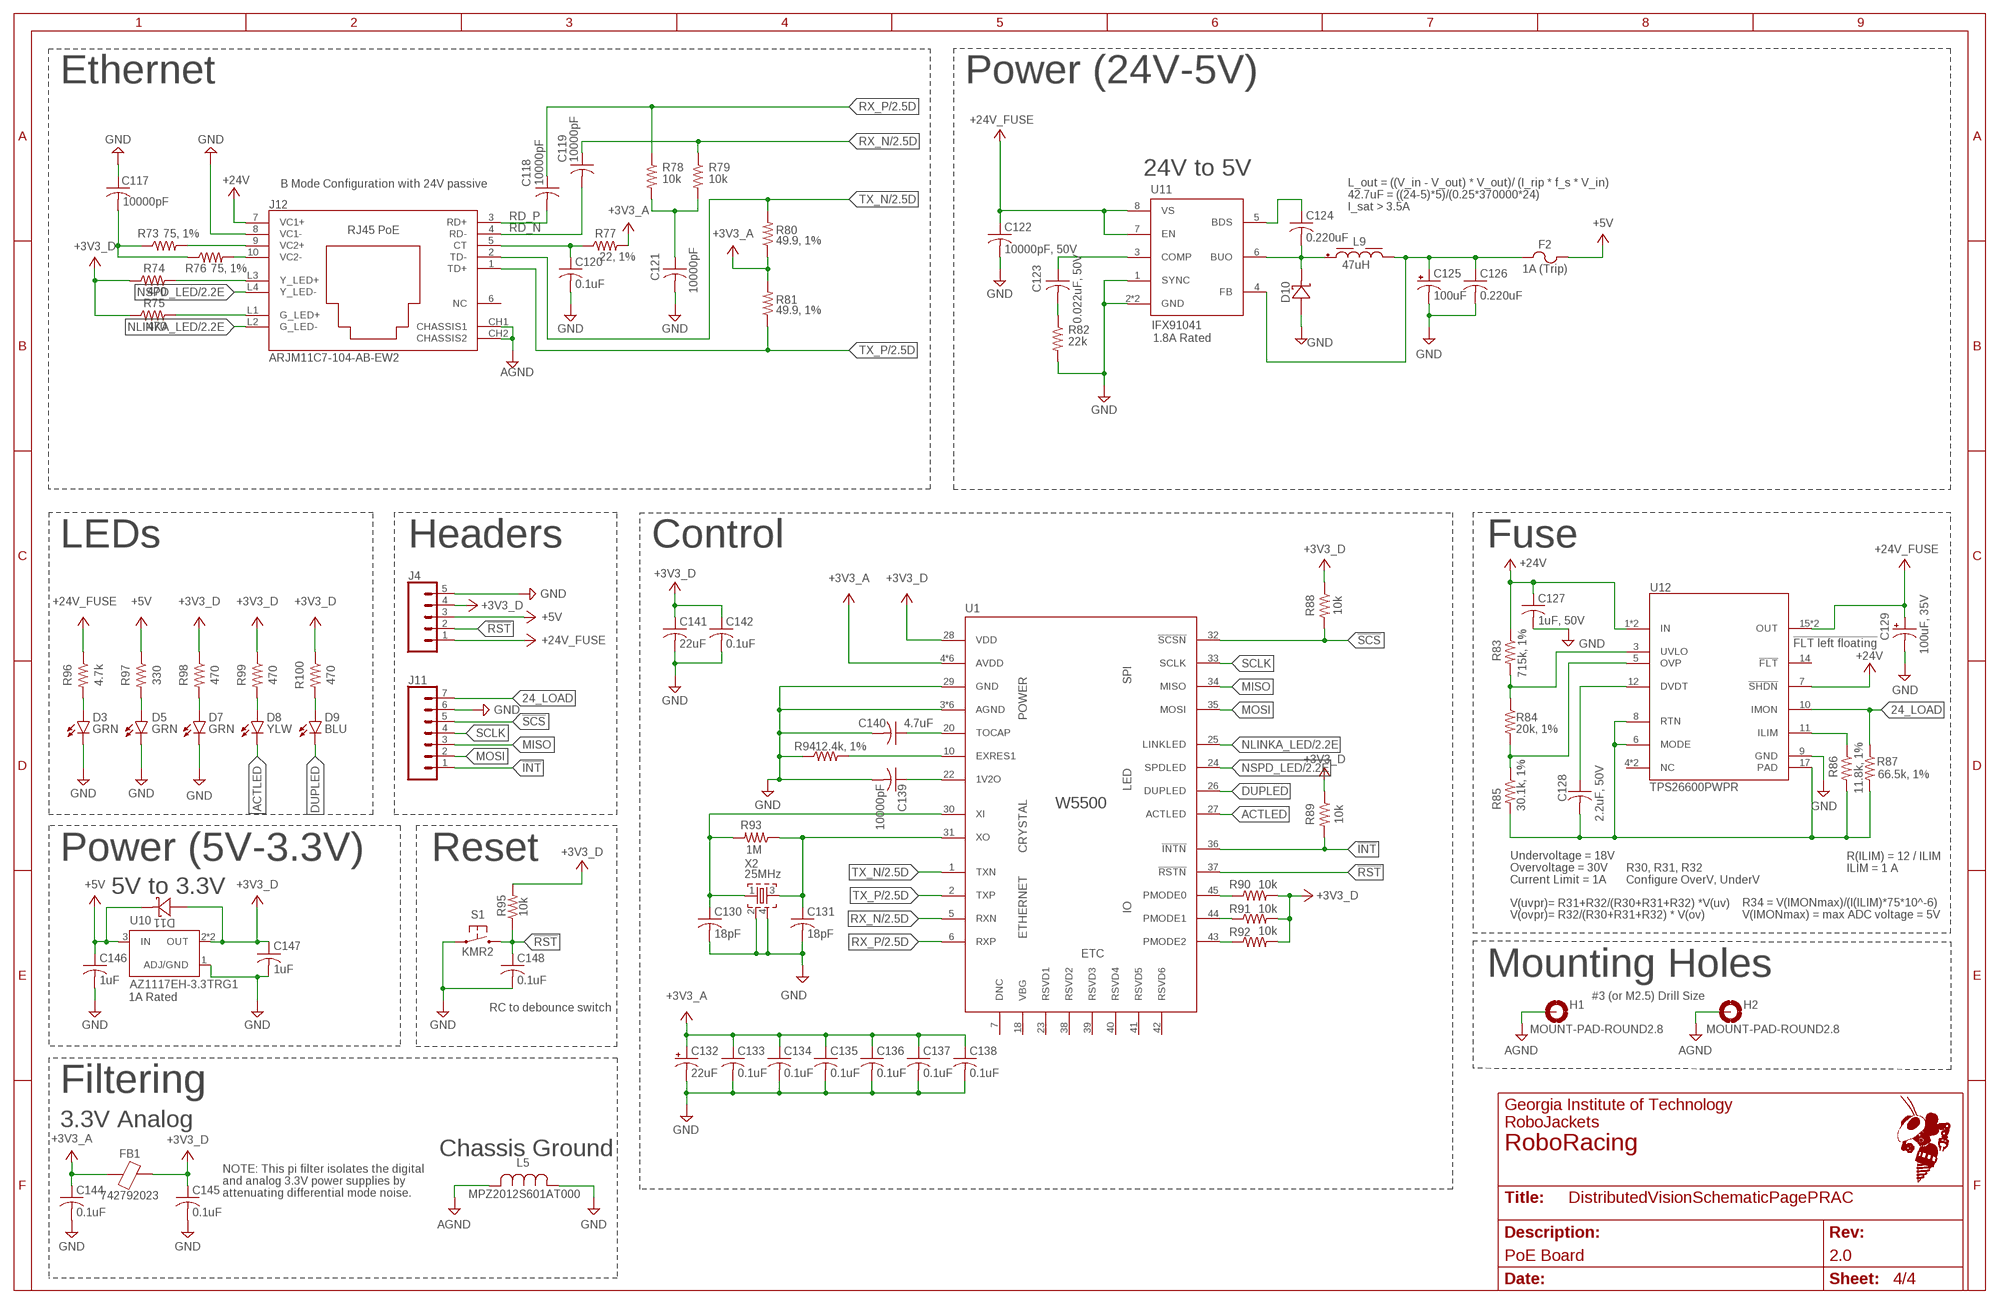
[diagram p3: schematic, sheet 4]
FRAME4 (FRAME_11_17): REVISION: 2.0; SCH_DESC: PoE Board; TEAM: RoboRacing

### Parts
C117  10000pF  C-USC0603  [C0603]
C118  10000pF  C-USC0402  [C0402]
C119  10000pF  C-USC0402  [C0402]
C120  0.1uF  C-USC0402  [C0402]
C121  10000pF  C-USC0603  [C0603]
C122  10000pF, 50V  C-USC0603  [C0603]
C123  0.022uF, 50V  C-USC0603  [C0603]
C124  0.220uF  C-USC0603  [C0603]
C125  100uF  CPOL-USE2-5  [E2-5]
C126  0.220uF  C-USC0603  [C0603]
C127  1uF, 50V  C-USC0603  [C0603]
C128  2.2uF, 50V  C-USC0603  [C0603]
C129  100uF, 35V  CPOL-USE2.5-7  [E2,5-7]
C130  18pF  C-USC0603  [C0603]
C131  18pF  C-USC0603  [C0603]
C132  22uF  22UF-POLAR-PANASONIC_C-35V-20%  [PANASONIC_C]
C133  0.1uF  C-USC0402  [C0402]
C134  0.1uF  C-USC0402  [C0402]
C135  0.1uF  C-USC0402  [C0402]
C136  0.1uF  C-USC0402  [C0402]
C137  0.1uF  C-USC0402  [C0402]
C138  0.1uF  C-USC0402  [C0402]
C139  10000pF  C-USC0402  [C0402]
C140  4.7uF  C-USC0603  [C0603]
C141  22uF  C-USC0603  [C0603]
C142  0.1uF  C-USC0402  [C0402]
C144  0.1uF  C-USC0603  [C0603]
C145  0.1uF  C-USC0603  [C0603]
C146  1uF  C-USC0603  [C0603]
C147  1uF  C-USC0603  [C0603]
C148  0.1uF  C-USC0402  [C0402]
D3  GRN  LEDCHIP-LED0603  [CHIP-LED0603]
D5  GRN  LEDCHIP-LED0603  [CHIP-LED0603]
D7  GRN  LEDCHIP-LED0603  [CHIP-LED0603]
D8  YLW  LEDCHIP-LED0603  [CHIP-LED0603]
D9  BLU  LEDCHIP-LED0603  [CHIP-LED0603]
D10  NTS260ESFT3G  [SOD123FL_DIO]
D11  NTS260ESFT3G  [SOD123FL_DIO]
F2  1A (Trip)  0ZCG0050AF2C  [0ZCG_BEL]
FB1  742792023  [0805]
H1  MOUNT-PAD-ROUND2.8  [2,8-PAD]
H2  MOUNT-PAD-ROUND2.8  [2,8-PAD]
J4  CONN_05  [1X05]
J11  CONN_07  [1X07]
J12  ARJM11C7-104-AB-EW2  [CONN_EW_ABR]
L5  MPZ2012S601AT000  [IND_2012_TDK]
L9  47uH  7447709470_7447709470  [WE-PD_1210]
R73  75, 1%  R-US_R0603  [R0603]
R74  470  R-US_R0603  [R0603]
R75  470  R-US_R0603  [R0603]
R76  75, 1%  R-US_R0603  [R0603]
R77  22, 1%  R-US_R0603  [R0603]
R78  10k  R-US_R0603  [R0603]
R79  10k  R-US_R0603  [R0603]
R80  49.9, 1%  R-US_R0402  [R0402]
R81  49.9, 1%  R-US_R0402  [R0402]
R82  22k  R-US_R0603  [R0603]
R83  715k, 1%  R-US_R0603  [R0603]
R84  20k, 1%  R-US_R0603  [R0603]
R85  30.1k, 1%  R-US_R0603  [R0603]
R86  11.8k, 1%  R-US_R0603  [R0603]
R87  66.5k, 1%  R-US_R0603  [R0603]
R88  10k  R-US_R0603  [R0603]
R89  10k  R-US_R0603  [R0603]
R90  10k  R-US_R0603  [R0603]
R91  10k  R-US_R0603  [R0603]
R92  10k  R-US_R0603  [R0603]
R93  1M  R-US_R0402  [R0402]
R94  12.4k, 1%  R-US_R0603  [R0603]
R95  10k  R-US_R0603  [R0603]
R96  4.7k  R-US_R0603  [R0603]
R97  330  R-US_R0603  [R0603]
R98  470  R-US_R0603  [R0603]
R99  470  R-US_R0603  [R0603]
R100  470  R-US_R0603  [R0603]
S1  KMR2  [KMR2]
U1  W5500  [48-LQFP]
U10  AZ1117EH-3.3TRG1  [SOT230P700X180-4N]
U11  IFX91041  [SOIC-8-EXPOSED_PAD]
U12  TPS26600PWPR  [PWP0016H_N]
X2  25MHz  ABM10W-25.0000MHZ-6-K1Z-T3  [OSCILLATOR-SMD-2.5X2]

### Nets
3V3_LED: D7.A R98.2
3V3_LED1: D8.A R99.2
3V3_LED2: D9.A R100.2
5V_LED: D5.A R97.2
5V_RAW: C124.2 D10.1 L9.1 U11.6(BUO)
24_LOAD: J11.7 R87.1 U12.10(IMON)
24V_LED: D3.A R96.2
!INT [spi]: J11.1 R89.2 U1.36(!INTN)
!RST: C148.1 J4.2 R95.1 S1.2.1 S1.2.2 U1.37(!RSTN)
!SCS [spi]: J11.5 R88.2 U1.32(!SCSN)
+3V3_A: C132.+ C133.1 C134.1 C135.1 C136.1 C137.1 C138.1 C144.1 FB1.1 R77.2 R80.1 R81.2 U1.4(AVDD) U1.8(AVDD) U1.11(AVDD) U1.15(AVDD) U1.17(AVDD) U1.21(AVDD)
+3V3_D [power]: C141.1 C142.1 C145.1 C147.1 D11.2 FB1.2 J4.4 R74.1 R75.1 R88.1 R89.1 R90.2 R91.2 R92.2 R95.2 R98.1 R99.1 R100.1 U1.28(VDD) U10.2(OUT) U10.4(OUT)
+5V: C146.1 D11.1 F2.2 J4.3 R97.1 U10.3(IN) ; also sheet 1,3
+5V_PREFUSE: C125.+ C126.1 F2.1 L9.2 U11.4(FB)
+24V: C127.1 J12.7(VC1+) R83.1 U12.1(IN) U12.2(IN) U12.7(!SHDN)
+24V_FUSE: C122.1 C129.+ J4.1 R96.1 U11.7(EN) U11.8(VS) U12.15(OUT) U12.16(OUT)
ACTLED: D8.C U1.27(ACTLED)
AGND: H1.B2,8(MOUNT) H2.B2,8(MOUNT) J12.CH1(CHASSIS1) J12.CH2(CHASSIS2) L5.2
CT: C120.1 J12.5(CT) R77.1
DUPLED: D9.C U1.26(DUPLED)
G_LED+: J12.L1(G_LED+) R75.2
GND: C117.1 C120.2 C121.2 C122.2 C125.- C126.2 C127.2 C129.- C130.2 C131.2 C132.- C133.2 C134.2 C135.2 C136.2 C137.2 C138.2 C139.2 C140.2 C141.2 C142.2 C144.2 C145.2 C146.2 C147.2 C148.2 D3.C D5.C D7.C D10.2 J4.5 J11.6 J12.8(VC1-) L5.1 R82.2 R94.1 S1.1.1 S1.1.2 U1.3(AGND) U1.9(AGND) U1.14(AGND) U1.16(AGND) U1.19(AGND) U1.29(GND) U1.48(AGND) U10.1(ADJ/GND) U11.1(SYNC) U11.2(GND) U11.9(GND) U12.9(GND) X2.2(SHD1) X2.4(SHD2) ; also sheet 1,2,3
MISO [spi]: J11.3 U1.34(MISO)
MOSI [spi]: J11.2 U1.35(MOSI)
N$2: C139.1 U1.22(1V2O)
N$3: C140.1 U1.20(TOCAP)
N$4: C123.1 U11.3(COMP)
N$7: R90.1 U1.45(PMODE0)
N$8: R91.1 U1.44(PMODE1)
N$9: R92.1 U1.43(PMODE2)
N$10: J12.9(VC2+) R73.2
N$11: C131.1 R93.1 U1.31(XO) X2.3(OUT)
N$13: C130.1 R93.2 U1.30(XI) X2.1(IN)
N$14: J12.10(VC2-) R76.2
N$15: C124.1 U11.5(BDS)
N$16: C123.2 R82.1
N$20: C117.2 R73.1 R76.1
N$21: R94.2 U1.10(EXRES1)
N$25: R83.2 R84.1 U12.3(UVLO)
N$28: R84.2 R85.1 U12.5(OVP)
N$29: C128.1 U12.12(DVDT)
N$34 [power]: R86.1 U12.11(ILIM)
NLINKA_LED: J12.L2(G_LED-) U1.25(LINKLED) ; also sheet 2
NSPD_LED: J12.L4(Y_LED-) U1.24(SPDLED) ; also sheet 2
RD_N [ethernet]: C119.2 J12.4(RD-)
RD_P [ethernet]: C118.2 J12.3(RD+)
RTN: C128.2 R85.2 R86.2 R87.2 U12.6(MODE) U12.8(RTN) U12.17(PAD)
RX_FILTER: C121.1 R78.2 R79.2
RX_N [ethernet]: C119.1 R79.1 U1.5(RXN) ; also sheet 2,3
RX_P [ethernet]: C118.1 R78.1 U1.6(RXP) ; also sheet 2,3
SCLK [spi]: J11.4 U1.33(SCLK)
TX_N [ethernet]: J12.2(TD-) R80.2 U1.1(TXN) ; also sheet 2,3
TX_P [ethernet]: J12.1(TD+) R81.1 U1.2(TXP) ; also sheet 2,3
Y_LED+: J12.L3(Y_LED+) R74.2
Unconnected: J12.6(NC) U1.7(DNC) U1.18(VBG) U1.23(RSVD1) U1.38(RSVD2) U1.39(RSVD3) U1.40(RSVD4) U1.41(RSVD5) U1.42(RSVD6) U12.4(NC) U12.13(NC) U12.14(!FLT)

### Notes on the sheet
- Ethernet | Power (24V-5V)
- 24V to 5V
- B Mode Configuration with 24V passive
- L_out = ((V_in - V_out) * V_out)/ (I_rip * f_s * V_in)
  42.7uF = ((24-5)*5)/(0.25*370000*24)
  I_sat > 3.5A
- 1.8A Rated
- LEDs | Headers | Control | Fuse
- !FLT left floating
- Power (5V-3.3V) | Reset
- R(ILIM) = 12 / ILIM
  ILIM = 1 A
- Undervoltage = 18V
  Overvoltage = 30V
  Current Limit = 1A
- R30, R31, R32 
  Configure OverV, UnderV
- 5V to 3.3V
- V(uvpr)= R31+R32/(R30+R31+R32) *V(uv)
- V(ovpr)= R32/(R30+R31+R32) * V(ov)
- R34 = V(IMONmax)/(I(ILIM)*75*10^-6)
  V(IMONmax) = max ADC voltage = 5V
- Mounting Holes
- 1A Rated | #3 (or M2.5) Drill Size
- RC to debounce switch
- Filtering
- 3.3V Analog
- Chassis Ground
- NOTE: This pi filter isolates the digital 
  and analog 3.3V power supplies by
  attenuating differential mode noise.

## Power pins joined to a net without a drawn wire
VC_TCK: J2.180(B:VC_TCK)
VC_TDO: J2.178(B:VC_TDO)
VDAC: J2.189(B:VDAC) J2.190(B:VDAC)
VDD18CORE_2: U3.15(VDD18CORE_2)
VDD33A_2: U3.5(VDD33A_2)
VDD33A_3: U3.10(VDD33A_3)
VDD33A_4: U3.49(VDD33A_4)
VDD33A_5: U3.51(VDD33A_5)
VDD33A_6: U3.54(VDD33A_6)
VDD33A_7: U3.57(VDD33A_7)
VDD33IO_2: U3.19(VDD33IO_2)
VDD33IO_3: U3.27(VDD33IO_3)
VDD33IO_4: U3.33(VDD33IO_4)
VDD33IO_5: U3.39(VDD33IO_5)

## Library data of the parts
C3-C29 C33-C73 C75-C86 C88 C91 C96 C102 C103 C117 C121-C124 C126-C128 C130 C131 C140 C141 C146 C147 = rcl:C-US: CAPACITOR, American symbol; SPICEPREFIX: C
C118-C120 C133-C139 C142 C144 C145 C148 = adafruit:C-US: CAPACITOR, American symbol
C125 = rcl:CPOL-US: POLARIZED CAPACITOR, American symbol; DKPN: 732-8598-1-ND; SPICEPREFIX: C
C129 = rcl:CPOL-US: POLARIZED CAPACITOR, American symbol; DKPN: 732-8942-1-ND; SPICEPREFIX: C
C132 = SparkFun-Capacitors:22UF-POLAR: 22µF polarized capacitors A capacitor is a passive two-terminal electrical component used to store electrical energy temporarily in an electric field.; PROD_ID: CAP-08618
D1 D2 D6 = RoboJackets-LEDs:LED-GREEN: Green SMD LED Used in manufacturing of various products at SparkFun Packages: 0603 - SMD 0603 package [Product Link] <http://www.futureelectronics.com/en/technologies/semiconductors/optoelectronics/leds/Pages/9894312-LTST-C190GKT.aspx?CrossPart=HSMG-C190&IM=0> LilyPad 1206 - SMD1206 LilyPad package [Product Link] <http://www.futureelectronics.com/en/Technologies/Product.aspx?ProductID=IN150NGHARVATEKCORPORATION2049943&IM=0> 1206 - SMD1206 package [Product Link] <http://www.futureelectronics.com/en/technologies/semiconductors/optoelectronics/leds/Pages/8315665-LTST-C150KGKT.aspx?IM=0> 1206 Bottom Mount -SMD 1206 Bottom Mount [Product Link] <http://www.digikey.com/product-detail/en/lite-on-inc/LTST-C230KGKT/160-1456-1-ND/386854> SparkFun Products: Pro Mini 328 -5V <https://www.sparkfun.com/products/821> RedBoard <https://www.sparkfun.com/products/12757> MP3 Trigger <https://www.sparkfun.com/products/13720> Makey Makey <https://www.sparkfun.com/products/11076>; PROD_ID: DIO-00821
D3 D5 D7-D9 = led:LED: LED OSRAM: - CHIPLED LG R971, LG N971, LY N971, LG Q971, LY Q971, LO R971, LY R971 LH N974, LH R974 LS Q976, LO Q976, LY Q976 LO Q996 - Hyper CHIPLED LW Q18S LB Q993, LB Q99A, LB R99A - SideLED LS A670, LO A670, LY A670, LG A670, LP A670 LB A673, LV A673, LT A673, LW A673 LH A674 LY A675 LS A676, LA A676, LO A676, LY A676, LW A676 LS A679, LY A679, LG A679 - Hyper Micro SIDELED® LS Y876, LA Y876, LO Y876, LY Y876 LT Y87S - SmartLED LW L88C, LW L88S LB L89C, LB L89S, LG L890 LS L89K, LO L89K, LY L89K LS L896, LA L896, LO L896, LY L896 - TOPLED LS T670, LO T670, LY T670, LG T670, LP T670 LSG T670, LSP T670, LSY T670, LOP T670, LYG T670 LG T671, LOG T671, LSG T671 LB T673, LV T673, LT T673, LW T673 LH T674 LS T676, LA T676, LO T676, LY T676, LB T676, LH T676, LSB T676, LW T676 LB T67C, LV T67C, LT T67C, LS T67K, LO T67K, LY T67K, LW E67C LS E67B, LA E67B, LO E67B, LY E67B, LB E67C, LV E67C, LT E67C LW T67C LS T679, LY T679, LG T679 LS T770, LO T770, LY T770, LG T770, LP T770 LB T773, LV T773, LT T773, LW T773 LH T774 LS E675, LA E675, LY E675, LS T675 LS T776, LA T776, LO T776, LY T776, LB T776 LHGB T686 LT T68C, LB T68C - Hyper Mini TOPLED® LB M676 - Mini TOPLED Santana® LG M470 LS M47K, LO M47K, LY M47K Source: http://www.osram.convergy.de LUXEON: - LUMILED® LXK2-PW12-R00, LXK2-PW12-S00, LXK2-PW14-U00, LXK2-PW14-V00 LXK2-PM12-R00, LXK2-PM12-S00, LXK2-PM14-U00 LXK2-PE12-Q00, LXK2-PE12-R00, LXK2-PE12-S00, LXK2-PE14-T00, LXK2-PE14-U00 LXK2-PB12-K00, LXK2-PB12-L00, LXK2-PB12-M00, LXK2-PB14-N00, LXK2-PB14-P00, LXK2-PB14-Q00 LXK2-PR12-L00, LXK2-PR12-M00, LXK2-PR14-Q00, LXK2-PR14-R00 LXK2-PD12-Q00, LXK2-PD12-R00, LXK2-PD12-S00 LXK2-PH12-R00, LXK2-PH12-S00 LXK2-PL12-P00, LXK2-PL12-Q00, LXK2-PL12-R00 Source: www.luxeon.com KINGBRIGHT: KA-3528ASYC Source: www.kingbright.com
D4 = RoboJackets-Diodes:DFLS160-7: Diode Schottky 60V 1A Surface Mount; DKPN: DFLS160DICT-ND
D10 D11 = ethernet_poe:NTS260ESFT3G: Diode Schottky 2A Surface Mount SOD-123FL; DKPN: NTS260ESFT3GOSCT-ND
F1 = RoboJackets-Fuses:PTCFUSE: PTC fuses, resettable thermistors
F2 = ethernet_poe:0ZCG0050AF2C: Polymeric PTC Resettable Fuse 30V 1A Current Trip, 500mA Current Hold Surface Mount 1812 (4532 Metric), Concave; DKPN: 507-1762-1-ND
FB1 = ethernet_poe:742792023: 120 Ohms @ 100MHz 1 Signal Line Ferrite Bead 0805 (2012 Metric) 3A 30mOhm; DKPN: 732-1613-1-ND
H1 H2 = holes:MOUNT-PAD-ROUND: MOUNTING PAD, round
IC1 = infineon:IPB180N06S4-H1: OptiMOS®-T2 Power-Transistor Source: 1859075.pdf (Farnell)
J2 = distributed-vision:RASPBERRRY_COMPUTE_CM3: RASPBERRY PI COMPUTE 3+ 16GB; DKPN: 1690-1031-ND
J3 = distributed-vision:XS10: Header for RPI Compute
J4 = SparkFun-Connectors:CONN_05: Multi connection point. Often used as Generic Header-pin footprint for 0.1 inch spaced/style header connections On any of the 0.1 inch spaced packages, you can populate with these: Break Away Headers - Straight <https://www.sparkfun.com/products/116> (PRT-00116) Break Away Male Headers - Right Angle <https://www.sparkfun.com/products/553> (PRT-00553) Female Headers <https://www.sparkfun.com/products/115> (PRT-00115) Break Away Headers - Machine Pin <https://www.sparkfun.com/products/117> (PRT-00117) Break Away Female Headers - Swiss Machine Pin <https://www.sparkfun.com/products/743> (PRT-00743) For SCREWTERMINALS and SPRING TERMINALS visit here: Screw Terimnals on SparkFun.com <https://www.sparkfun.com/search/results?term=Screw+Terminals> (5mm/3.5mm/2.54mm spacing) This device is also useful as a general connection point to wire up your design to another part of your project. Our various solder wires solder well into these plated through hole pads. Hook-Up Wire - Assortment (Stranded, 22 AWG) <https://www.sparkfun.com/products/11375> (PRT-11375) Hook-Up Wire - Assortment (Solid Core, 22 AWG) <https://www.sparkfun.com/products/11367> (PRT-11367) View the entire wire category on our website here <https://www.sparkfun.com/categories/141> Special notes: Molex polarized connector foot print use with SKU : PRT-08231 with associated crimp pins and housings. 1MM SMD Version SKU: PRT-10208
J5 = RoboJackets-Connectors:1981584-1: CONN RCPT MICRO USB TYPE AB https://www.digikey.com/product-detail/en/te-connectivity-amp-connectors/1981584-1/A97799TR-ND/1786247; CENTERLINE_PITCH: .65 mm[.025 in]; COMMENT: 1981584-1; DESCRIPTION: REC TYPE AB ASSY _Au_ MICRO USB; DIGI-KEY_PART_NUMBER: A97799CT-ND; DIGI-KEY_PURCHASE_URL: https://www.digikey.com/product-detail/en/te-connectivity-amp-connectors/1981584-1/A97799CT-ND/1786249?utm_source=snapeda&utm_medium=aggregator&utm_campaign=symbol; MF: TE Connectivity; MP: 1981584-1; NUMBER_OF_POSITIONS: 5; PACKAGE: None; PRODUCT_TYPE: Connector; TE_PURCHASE_URL: https://www.te.com/usa-en/product-1981584-1.html?te_bu=Cor&te_type=disp&te_campaign=seda_glo_cor-seda-global-disp-prtnr-fy19-seda-model-bom-cta_sma-317_1&elqCampaignId=32493
J6 = distributed-vision:DM3D-SF: 10 (8 + 2) Position Card Connector Secure Digital - microSD™ Surface Mount, Right Angle Gold; DKPN: HR1941CT-ND
J7 = distributed-vision:10029449-111RLF: HDMI HDMI 1.4 Receptacle Connector 19 Position Surface Mount, Right Angle; Through Hole; DKPN: 609-4614-1-ND
J8 J9 = 1-84952-5:1-84952-5; COMMENT: 1-84952-5; DESCRIPTION: Conn FPC Connector SKT 15 POS 1mm Solder RA SMD T/R; DIGI-KEY_PART_NUMBER: A101391CT-ND; EU_ROHS_COMPLIANCE: Compliant; MF: TE Connectivity; MP: 1-84952-5; PACKAGE: None; PURCHASE-URL: https://pricing.snapeda.com/search/part/1-84952-5/?ref=eda
J10 = distributed-vision:USBR-A-D-F-O-TH: USB-A (USB TYPE-A) USB 2.0 Receptacle Connector 8 Position Through Hole, Right Angle; DKPN: SAM10376-ND
J11 = SparkFun-Connectors:CONN_07: Multi connection point. Often used as Generic Header-pin footprint for 0.1 inch spaced/style header connections On any of the 0.1 inch spaced packages, you can populate with these: Break Away Headers - Straight <https://www.sparkfun.com/products/116> (PRT-00116) Break Away Male Headers - Right Angle <https://www.sparkfun.com/products/553> (PRT-00553) Female Headers <https://www.sparkfun.com/products/115> (PRT-00115) Break Away Headers - Machine Pin <https://www.sparkfun.com/products/117> (PRT-00117) Break Away Female Headers - Swiss Machine Pin <https://www.sparkfun.com/products/743> (PRT-00743) For SCREWTERMINALS and SPRING TERMINALS visit here: Screw Terimnals on SparkFun.com <https://www.sparkfun.com/search/results?term=Screw+Terminals> (5mm/3.5mm/2.54mm spacing) This device is also useful as a general connection point to wire up your design to another part of your project. Our various solder wires solder well into these plated through hole pads. Hook-Up Wire - Assortment (Stranded, 22 AWG) <https://www.sparkfun.com/products/11375> (PRT-11375) Hook-Up Wire - Assortment (Solid Core, 22 AWG) <https://www.sparkfun.com/products/11367> (PRT-11367) View the entire wire category on our website here <https://www.sparkfun.com/categories/141> Special notes: Molex polarized connector foot print use with SKU : PRT-08231 with associated crimp pins and housings. 1MM SMD Version SKU: PRT-10208 NOTES ON THE VARIANTS LOCK and LOCK_LONGPADS... This footprint was designed to help hold the alignment of a through-hole component (i.e. 6-pin header) while soldering it into place. You may notice that each hole has been shifted either up or down by 0.005 of an inch from it's more standard position (which is a perfectly straight line). This slight alteration caused the pins (the squares in the middle) to touch the edges of the holes. Because they are alternating, it causes a "brace" to hold the component in place. 0.005 has proven to be the perfect amount of "off-center" position when using our standard breakaway headers. Although looks a little odd when you look at the bare footprint, once you have a header in there, the alteration is very hard to notice. Also,if you push a header all the way into place, it is covered up entirely on the bottom side.
J12 = ethernet_poe:ARJM11C7-104-AB-EW2: 1 Port RJ45 Magjack Connector Through Hole 10/100 Base-T, AutoMDIX, Power over Ethernet (PoE); DKPN: 535-14148-ND
JP1 = RoboJackets-Connectors:PINHD-1X2: PIN HEADER
JP2 = RoboJackets-Connectors:PINHD-1X4: PIN HEADER
L1-L4 L6-L8 = RoboJackets-Inductors:INDUCTOR_0805: Generic 0805 Inductor
L5 = POE:MPZ2012S601AT000; BUILT_BY: EMA_UL_Team; MANUFACTURER_PART_NUMBER: MPZ2012S601AT000; SOURCELIBRARY: TDK_2015_05_22; VENDOR: TDK
L9 = ethernet_poe_v2.1:7447709470: WE-PD SMT Power Inductor Characteristics AECQ 200 Qualified Ultra low RDC and RAC Highest possible saturation current based on Ferrite Suitable for switching frequency up to 10MHz Temperature dependent parameter available on Redexpert Operating Temperature from -40°C to +125°C / +150°C Types WE-PD: Since always with low loss material, tight tolerances and high saturation behavior compared to other manufacturers in the market WE-PD Robust: Plastic base improves the mechanical stability and efficiency WE-PD Performance: MnZn core improves Saturation and RDC for highest efficiency Applications Switch Mode Power supplies from 0,1W up to 300W Integrated DC DC Converter Ideal for Switch Mode Power supplies with extreme high efficiency (>95%) <https://www.we-online.com/catalog/media/o14825v209%20Family_WE-PD.jpg> Details see: https://www.we-online.com/catalog/en/WE-PD/ Details see: https://katalog.we-online.com/en/pbs/WE-PD Updated by Yingchun,Shan 2019-07-25 2019 (C) Wurth Elektronik; DATASHEET-URL: https://www.we-online.com/catalog/datasheet/7447709470.pdf; DKPN: 732-1246-1-ND; FRES: 6.5MHz; IR: 3.8A; ISAT: 4.5A; MOUNT: SMT; PART-NUMBER: 7447709470; RDC-MAX: 60mOhm; RDC-TYP: 46mOhm; VERSION: Standard
LED1-LED3 = led:*P4: PointLED® Enhanced Thinfilm LED TOP & BOTTOM mount LS P47F, LR P47F, LA P47F, LY P47F, LT P4SG, LB P4SG, LW P4SG Source: http://catalog.osram-os.com .. LA_LR_LS_LY_P47F_Pb_free.pdf
Q1 = distributed-vision:AP2331SA-7: A single channel current-limited load switch; DKPN: AP2331SA-7DICT-ND
Q2-Q4 = RoboJackets-Discrete:BSS127: MOSFET N-CH 600V SOT23 with multiple current ratings; DKPN: BSS127S-7DICT-ND
Q5 = RoboJackets-Discrete:PSMN014-40YS: N-channel LFPAK 40V, 14 mOhm MOSFET; DKPN: 1727-4624-1-ND
Q6 = crystal:FA-: MHz RANGE CRYSTAL UNIT Source: Epson Toyocom
R1 R4 R7-R14 R16 R20-R25 R38 R42-R44 R46-R50 R52-R55 R73-R79 R82-R92 R94-R100 = rcl:R-US_: RESISTOR, American symbol; SPICEPREFIX: R
R18 R19 R26-R32 R39-R41 R51 R56 = RoboJackets-Resistors:ERJ-L06KF50MV: Current Sensing Resistor Datasheet <https://industrial.panasonic.com/cdbs/www-data/pdf/RDN0000/AOA0000C313.pdf>; DKPN: P50LLCT-ND
R80 R81 R93 = adafruit:R-US_: RESISTOR, American symbol
RN42 RN43 = RoboJackets-Resistors:RA-4: Isolated Network Resistor Array x4
S1 = RoboJackets-Switches:KMR2; FUNCTION: Reset
S2 = RoboJackets-Switches:34EWMSP12M6RT; DKPN: GH7540CT-ND
T1 = transistor:*-NPN_DRIVER-: NPN Bias Resistor Transistor
U1 = ethernet_poe:W5500: Chip to control 10/100 Ethernet and output data over SPI; DKPN: 1278-1021-ND
U2 = distributed-vision:LM26420XMH: Frequency Synchronous Step-Down DCDC Regulator. Datasheet link: https://www.ti.com/lit/ds/symlink/lm26420.pdf?ts=1604867907885&ref_url=https%253A%252F%252Fwww.google.com%252F; DKPN: 296-46301-1-ND
U3 = distributed-vision:LAN9513-JZX: USB to Ethernet. Datasheet link: https://ww1.microchip.com/downloads/en/DeviceDoc/00002305A.pdf; DKPN: LAN9513-JZX-ND
U4 = distributed-vision:ESD224: 14V Clamp 2A (8/20µs) Ipp Tvs Diode Surface Mount 10-USON (2.5x1); DKPN: 296-51107-1-ND
U5 = distributed-vision:FSUSB42MUX: USB Switch IC Channel 10-MSOP; DKPN: FSUSB42MUXCT-ND
U6-U9 = distributed-vision:SP3003-02: TVS DIODE ARRAY; DKPN: F3302CT-ND
U10 = ethernet_poe:AZ1117EH-3.3TRG1: LDO Voltage Regulator 3.3V, 1A, Sot223; DKPN: AZ1117EH-3.3TRG1DICT-ND
U11 = ethernet_poe:IFX91041: 1.8A DC/DC Step-Down Voltage Regulator 5.0V, 3.3V, or Adjustable Output; DKPN: IFX91041EJV50XUMA1CT-ND
U12 = ethernet_poe:TPS26600PWPR; DKPN: 296-47292-1-ND
X1 = RoboJackets-Connectors:JST-XH-02-PIN: JST XH Connector 2 Pin Wire to board connector. Pitch: 2,54 mm, (0.100") Number of pins: 2 Created by Rembrandt Electronics www.rembrandtelectronics.com
X2 = ethernet_poe_v2.1:ABM10W-25.0000MHZ-6-K1Z-T3: 25MHz ±10ppm Crystal 6pF 50 Ohms 4-SMD, No Lead; DKPN: 535-13730-1-ND

## Net classes
0 default: width 0.203 mm, drill 0.4 mm, clearance 0.203 mm
1 power: width 0.203 mm, drill 0.4 mm, clearance 0.203 mm to class 0, clearance 0.203 mm
2 ethernet: width 0.16 mm, drill 0.3 mm, clearance 0.152 mm
3 spi: width 0.207 mm, drill 0.35 mm